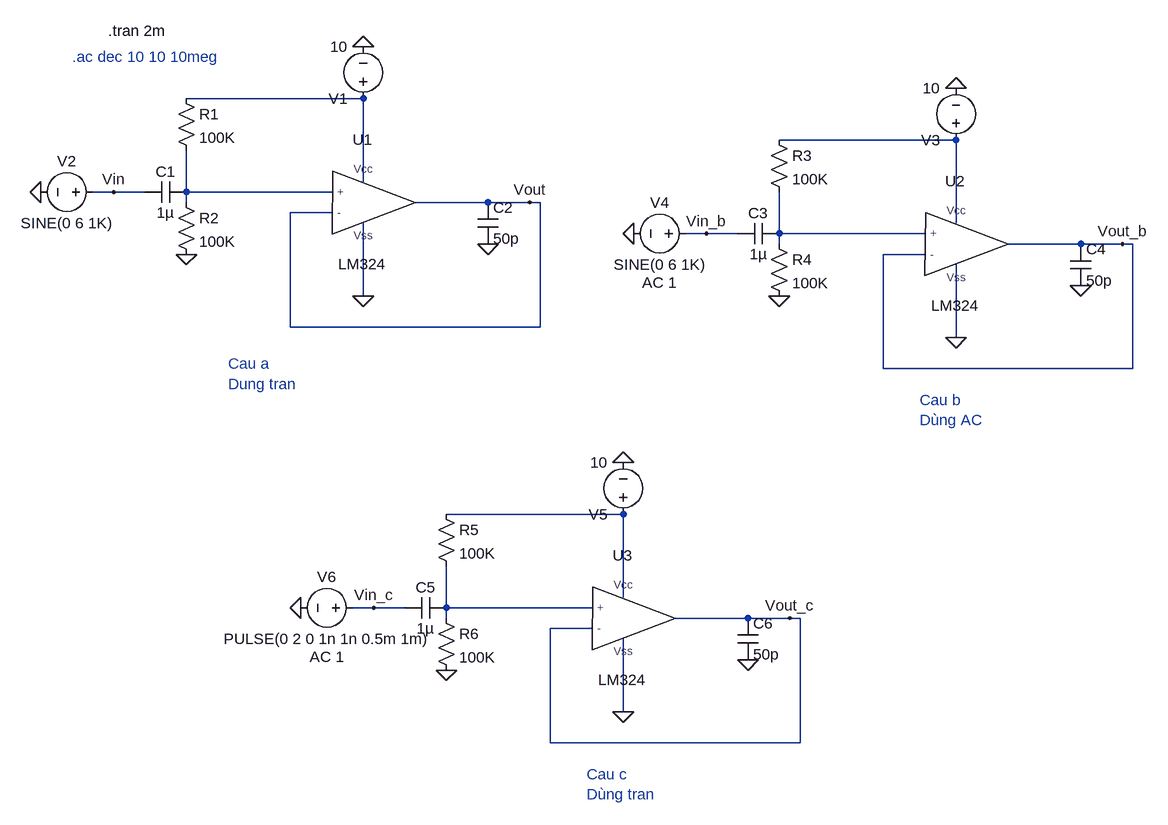
[diagram p0: schematic BAI 2 THUC HANH 4.asc]
BAI 2 THUC HANH 4.asc, the LTspice schematic file:
Version 4.1
SHEET 1 1452 1068
WIRE 224 -16 -48 -16
WIRE 1136 48 864 48
WIRE 224 112 224 -16
WIRE -160 128 -192 128
WIRE -112 128 -160 128
WIRE -48 128 -48 64
WIRE 176 128 -48 128
WIRE -48 144 -48 128
WIRE 416 144 304 144
WIRE 480 144 416 144
WIRE 496 144 480 144
WIRE 176 160 112 160
WIRE 1136 176 1136 48
WIRE 752 192 720 192
WIRE 800 192 752 192
WIRE 864 192 864 128
WIRE 1088 192 864 192
WIRE 864 208 864 192
WIRE 1328 208 1216 208
WIRE 1392 208 1328 208
WIRE 1408 208 1392 208
WIRE 1088 224 1024 224
WIRE 224 288 224 176
WIRE 112 336 112 160
WIRE 496 336 496 144
WIRE 496 336 112 336
WIRE 1136 352 1136 240
WIRE 1024 400 1024 224
WIRE 1408 400 1408 208
WIRE 1408 400 1024 400
WIRE 624 624 352 624
WIRE 624 752 624 624
WIRE 240 768 208 768
WIRE 288 768 240 768
WIRE 352 768 352 704
WIRE 576 768 352 768
WIRE 352 784 352 768
WIRE 816 784 704 784
WIRE 880 784 816 784
WIRE 896 784 880 784
WIRE 576 800 512 800
WIRE 624 928 624 816
WIRE 512 976 512 800
WIRE 896 976 896 784
WIRE 896 976 512 976
FLAG -160 128 Vin
FLAG 224 -96 0
FLAG -272 128 0
FLAG 224 288 0
FLAG 480 144 Vout
FLAG -48 224 0
FLAG 416 208 0
FLAG 752 192 Vin_b
FLAG 1136 -32 0
FLAG 640 192 0
FLAG 1136 352 0
FLAG 1392 208 Vout_b
FLAG 864 288 0
FLAG 1328 272 0
FLAG 240 768 Vin_c
FLAG 624 544 0
FLAG 128 768 0
FLAG 624 928 0
FLAG 880 784 Vout_c
FLAG 352 864 0
FLAG 816 848 0
SYMBOL LM324 224 144 R0
SYMATTR InstName U1
SYMBOL res -64 -32 R0
SYMATTR InstName R1
SYMATTR Value 100K
SYMBOL res -64 128 R0
SYMATTR InstName R2
SYMATTR Value 100K
SYMBOL cap -48 112 R90
WINDOW 0 0 32 VBottom 2
WINDOW 3 32 32 VTop 2
SYMATTR InstName C1
SYMATTR Value 1µ
SYMBOL voltage 224 0 R180
WINDOW 123 0 0 Left 0
WINDOW 39 0 0 Left 0
SYMATTR InstName V1
SYMATTR Value 10
SYMBOL voltage -176 128 R90
WINDOW 0 -32 56 VBottom 2
WINDOW 3 32 56 VTop 2
WINDOW 123 0 0 Left 0
WINDOW 39 0 0 Left 0
SYMATTR InstName V2
SYMATTR Value SINE(0 6 1K)
SYMBOL cap 400 144 R0
SYMATTR InstName C2
SYMATTR Value 50p
SYMBOL LM324 1136 208 R0
SYMATTR InstName U2
SYMBOL res 848 32 R0
SYMATTR InstName R3
SYMATTR Value 100K
SYMBOL res 848 192 R0
SYMATTR InstName R4
SYMATTR Value 100K
SYMBOL cap 864 176 R90
WINDOW 0 0 32 VBottom 2
WINDOW 3 32 32 VTop 2
SYMATTR InstName C3
SYMATTR Value 1µ
SYMBOL voltage 1136 64 R180
WINDOW 123 0 0 Left 0
WINDOW 39 0 0 Left 0
SYMATTR InstName V3
SYMATTR Value 10
SYMBOL voltage 736 192 R90
WINDOW 0 -32 56 VBottom 2
WINDOW 3 32 56 VTop 2
WINDOW 123 60 56 VTop 2
WINDOW 39 0 0 Left 0
SYMATTR InstName V4
SYMATTR Value SINE(0 6 1K)
SYMATTR Value2 AC 1
SYMBOL cap 1312 208 R0
SYMATTR InstName C4
SYMATTR Value 50p
SYMBOL LM324 624 784 R0
SYMATTR InstName U3
SYMBOL res 336 608 R0
SYMATTR InstName R5
SYMATTR Value 100K
SYMBOL res 336 768 R0
SYMATTR InstName R6
SYMATTR Value 100K
SYMBOL cap 352 752 R90
WINDOW 0 0 32 VBottom 2
WINDOW 3 32 32 VTop 2
SYMATTR InstName C5
SYMATTR Value 1µ
SYMBOL voltage 624 640 R180
WINDOW 123 0 0 Left 0
WINDOW 39 0 0 Left 0
SYMATTR InstName V5
SYMATTR Value 10
SYMBOL voltage 224 768 R90
WINDOW 0 -32 56 VBottom 2
WINDOW 3 32 56 VTop 2
WINDOW 123 60 56 VTop 2
WINDOW 39 0 0 Left 0
SYMATTR InstName V6
SYMATTR Value PULSE(0 2 0 1n 1n 0.5m 1m)
SYMATTR Value2 AC 1
SYMBOL cap 800 784 R0
SYMATTR InstName C6
SYMATTR Value 50p
TEXT -168 -120 Left 2 !.tran 2m
TEXT -224 -80 Left 2 ;.ac dec 10 10 10meg
TEXT 16 392 Left 2 ;Cau a\nDung tran
TEXT 1080 448 Left 2 ;Cau b\nDùng AC
TEXT 568 1024 Left 2 ;Cau c\nDùng tran

The netlist it stands for:
* BAI 2 THUC HANH 4.asc
X§U1 N003 Vout N001 0 Vout LM324  ; pins + - Vcc Vss ?
R1 N001 N003 100K
R2 N003 0 100K
C1 N003 Vin 1µ
V1 N001 0 10
V2 Vin 0 SINE(0 6 1K)
C2 Vout 0 50p
X§U2 N004 Vout_b N002 0 Vout_b LM324  ; pins + - Vcc Vss ?
R3 N002 N004 100K
R4 N004 0 100K
C3 N004 Vin_b 1µ
V3 N002 0 10
V4 Vin_b 0 SINE(0 6 1K) AC 1
C4 Vout_b 0 50p
X§U3 N006 Vout_c N005 0 Vout_c LM324  ; pins + - Vcc Vss ?
R5 N005 N006 100K
R6 N006 0 100K
C5 N006 Vin_c 1µ
V5 N005 0 10
V6 Vin_c 0 PULSE(0 2 0 1n 1n 0.5m 1m) AC 1
C6 Vout_c 0 50p
.tran 2m
* .ac dec 10 10 10meg
* Cau a
* Dung tran
* Cau b
* Dùng AC
* Cau c
* Dùng tran
.lib E:\ThiThucHanhCoHa\CoHa\LM324.cir
.backanno
.end